# Altium schematic sheet Mics_bus.SchDoc: Main
size A4; SheetNumber: 1
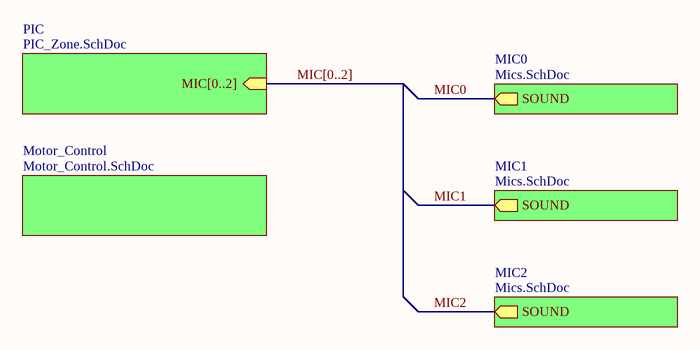
[diagram p0: Mics_bus.SchDoc]

## Sub-sheets
MIC0 = Mics.SchDoc: SOUND (out)
MIC1 = Mics.SchDoc: SOUND (out)
MIC2 = Mics.SchDoc: SOUND (out)
Motor_Control = Motor_Control.SchDoc: no entries
PIC = PIC_Zone.SchDoc: MIC[0..2] (in)

## Nets
MIC0: sheet MIC0/SOUND
MIC1: sheet MIC1/SOUND
MIC2: sheet MIC2/SOUND

## Buses and harness runs
bus MIC[0..2] = sheet PIC/MIC[0..2]

## Notes on the sheet
- Title
- Size:
- Date:
- A4
- Number:
- Time:
- Revision:
- Sheet
- of
- File: